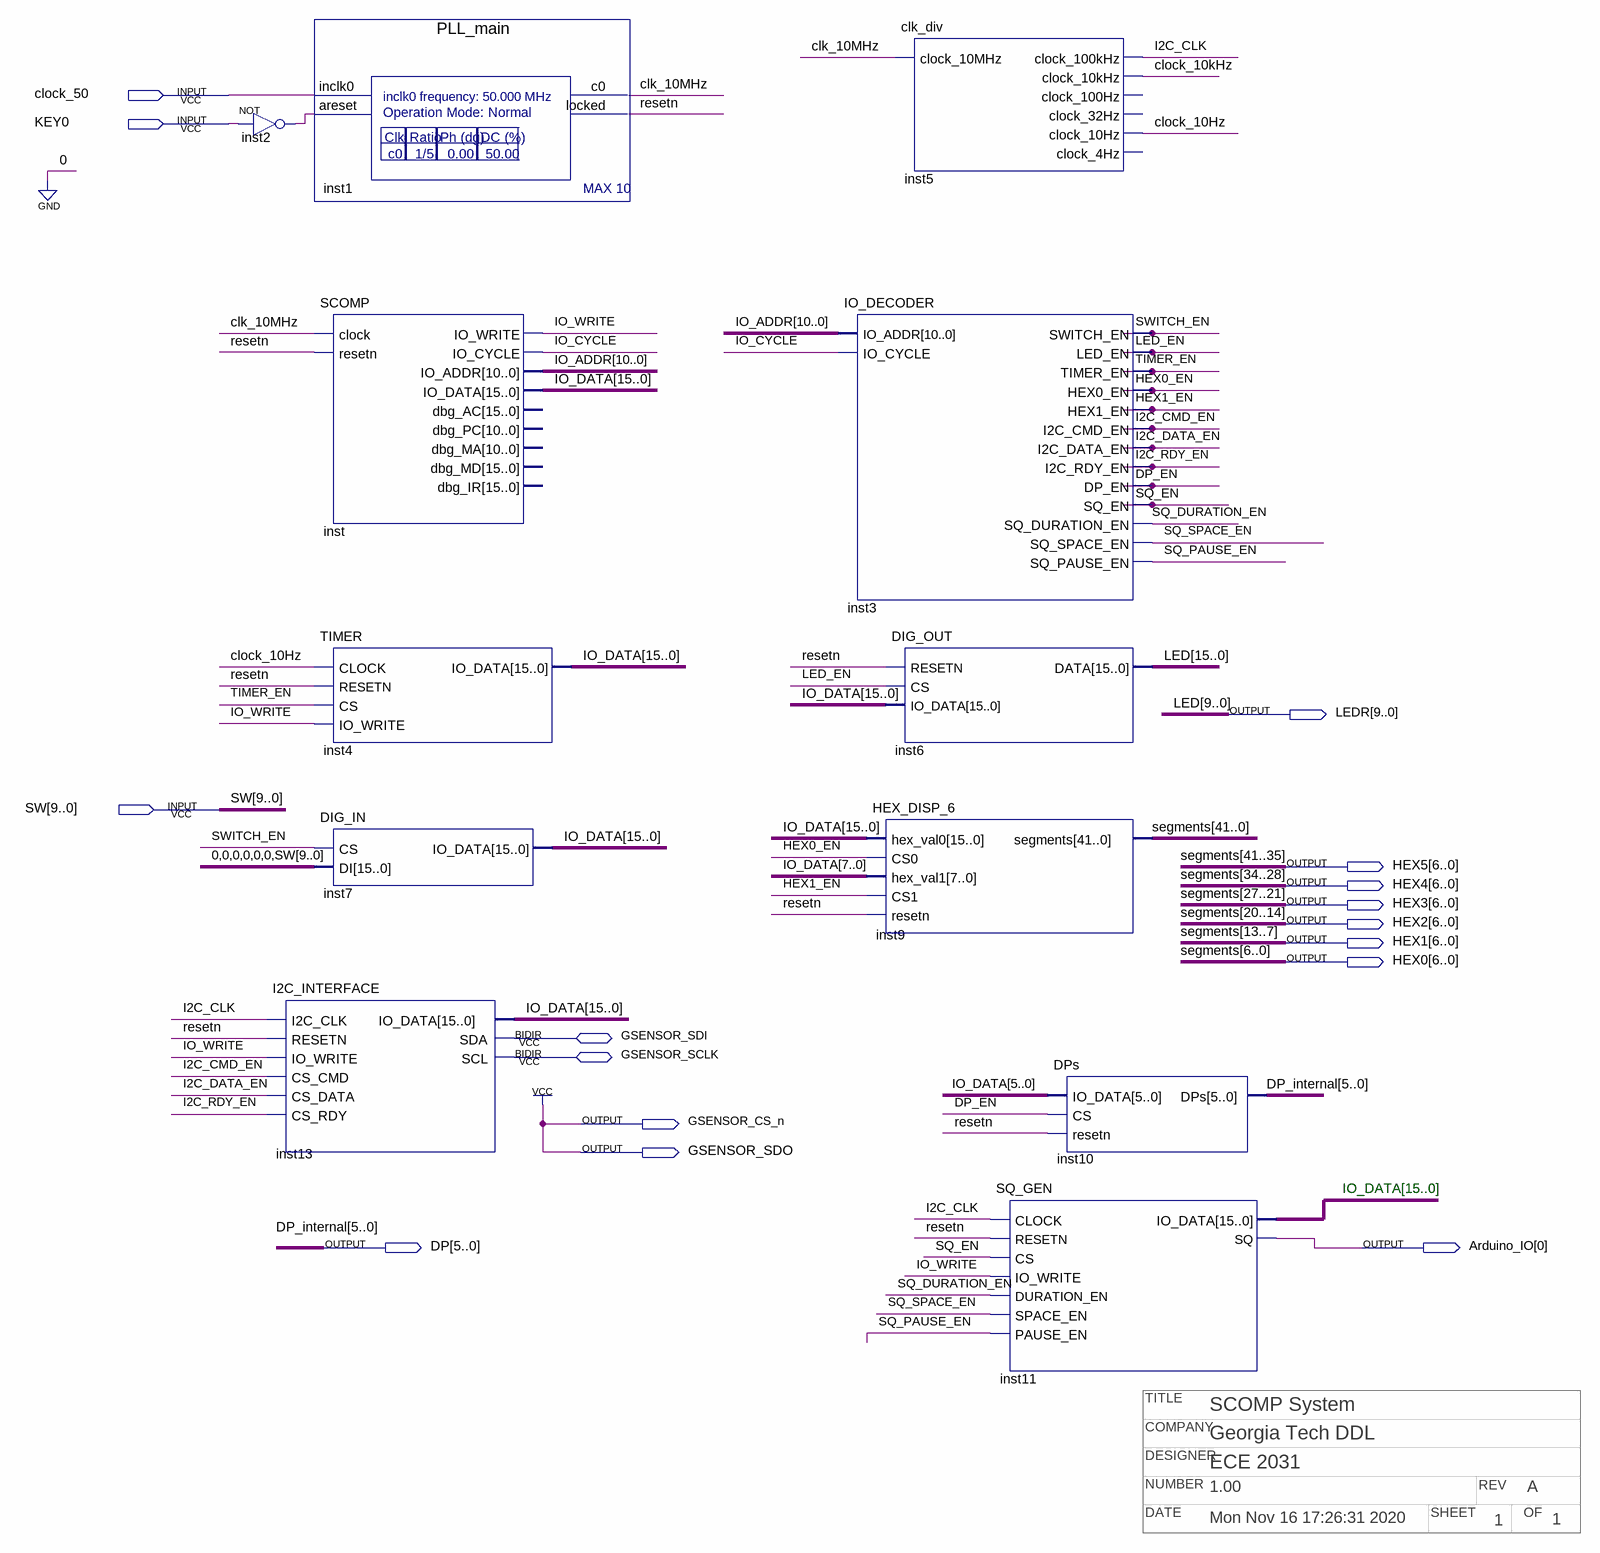
[diagram p0: schematic sheet]
// Quartus schematic SCOMP_System.bdf as structural Verilog: 12 symbols, 16 pins
// Title block: COMPANY: Georgia Tech DDL; DATE: Mon Nov 16 17:26:31 2020; DESIGNER: ECE 2031; NUMBER: 1.00; OF: 1; REV: A; SHEET: 1; TITLE: SCOMP System
module SCOMP_System (
  input  clock_50,
  input  KEY0,
  input  [9:0] SW,
  inout  GSENSOR_SDI,
  inout  GSENSOR_SCLK,
  output [9:0] LEDR,
  output [6:0] HEX5,
  output [6:0] HEX4,
  output [6:0] HEX3,
  output [6:0] HEX2,
  output [6:0] HEX1,
  output [6:0] HEX0,
  output GSENSOR_CS_n,
  output GSENSOR_SDO,
  output [5:0] DP,
  output [0:0] Arduino_IO
);

  wire clk_10MHz, clock_10Hz, clock_10kHz, DP_EN, HEX0_EN, HEX1_EN, I2C_CLK, I2C_CMD_EN, I2C_DATA_EN,
       I2C_RDY_EN, inst2_out, IO_CYCLE, IO_WRITE, LED_EN, resetn, SQ_DURATION_EN, SQ_EN, SQ_PAUSE_EN,
       SQ_SPACE_EN, SWITCH_EN, TIMER_EN;
  wire [10:0] IO_ADDR;
  wire [15:0] IO_DATA;
  wire [15:10] LED;

  not inst2 (inst2_out, KEY0);
  PLL_main inst1 (.inclk0(clock_50), .areset(inst2_out), .c0(clk_10MHz), .locked(resetn));
  SCOMP inst (
    .clock(clk_10MHz), .resetn(resetn), .IO_WRITE(IO_WRITE), .IO_CYCLE(IO_CYCLE), .IO_ADDR(IO_ADDR),
    .IO_DATA(IO_DATA));  // open: dbg_AC, dbg_PC, dbg_MA, dbg_MD, dbg_IR
  TIMER inst4 (.CLOCK(clock_10Hz), .RESETN(resetn), .CS(TIMER_EN), .IO_WRITE(IO_WRITE), .IO_DATA(IO_DATA));
  DIG_IN inst7 (.CS(SWITCH_EN), .DI({{6{1'b0}}, SW}), .IO_DATA(IO_DATA));
  I2C_INTERFACE inst13 (
    .I2C_CLK(I2C_CLK), .RESETN(resetn), .IO_WRITE(IO_WRITE), .CS_CMD(I2C_CMD_EN), .CS_DATA(I2C_DATA_EN),
    .CS_RDY(I2C_RDY_EN), .IO_DATA(IO_DATA), .SDA(GSENSOR_SDI), .SCL(GSENSOR_SCLK));
  IO_DECODER inst3 (
    .IO_ADDR(IO_ADDR), .IO_CYCLE(IO_CYCLE), .SWITCH_EN(SWITCH_EN), .LED_EN(LED_EN), .TIMER_EN(TIMER_EN),
    .HEX0_EN(HEX0_EN), .HEX1_EN(HEX1_EN), .I2C_CMD_EN(I2C_CMD_EN), .I2C_DATA_EN(I2C_DATA_EN),
    .I2C_RDY_EN(I2C_RDY_EN), .DP_EN(DP_EN), .SQ_EN(SQ_EN), .SQ_DURATION_EN(SQ_DURATION_EN),
    .SQ_SPACE_EN(SQ_SPACE_EN), .SQ_PAUSE_EN(SQ_PAUSE_EN));
  clk_div inst5 (
    .clock_10MHz(clk_10MHz), .clock_100kHz(I2C_CLK), .clock_10kHz(clock_10kHz), .clock_10Hz(clock_10Hz));  // open: clock_100Hz, clock_32Hz, clock_4Hz
  DIG_OUT inst6 (.RESETN(resetn), .CS(LED_EN), .IO_DATA(IO_DATA), .DATA({LED, LEDR}));
  HEX_DISP_6 inst9 (
    .hex_val0(IO_DATA), .CS0(HEX0_EN), .hex_val1(IO_DATA[7:0]), .CS1(HEX1_EN), .resetn(resetn),
    .segments({HEX5, HEX4, HEX3, HEX2, HEX1, HEX0}));
  SQ_GEN inst11 (
    .CLOCK(I2C_CLK), .RESETN(resetn), .CS(SQ_EN), .IO_WRITE(IO_WRITE), .DURATION_EN(SQ_DURATION_EN),
    .SPACE_EN(SQ_SPACE_EN), .PAUSE_EN(SQ_PAUSE_EN), .SQ(Arduino_IO[0]), .IO_DATA(IO_DATA));
  DPs inst10 (.IO_DATA(IO_DATA[5:0]), .CS(DP_EN), .resetn(resetn), .DPs(DP));

  assign GSENSOR_CS_n = 1'b1;
  assign GSENSOR_SDO = 1'b1;

  // Other names for the same wires on the sheet: DP_internal[5:0] = DP; LED[9:0] = LEDR;
  //   segments[41:0] = {HEX5, HEX4, HEX3, HEX2, HEX1, HEX0}

  // Notes on the sheet:
  //   IO_DATA[15..0]
endmodule
